# Altium schematic sheet InfraredEmitter.SchDoc
size A4; SheetNumber: 1; SheetTotal: 1
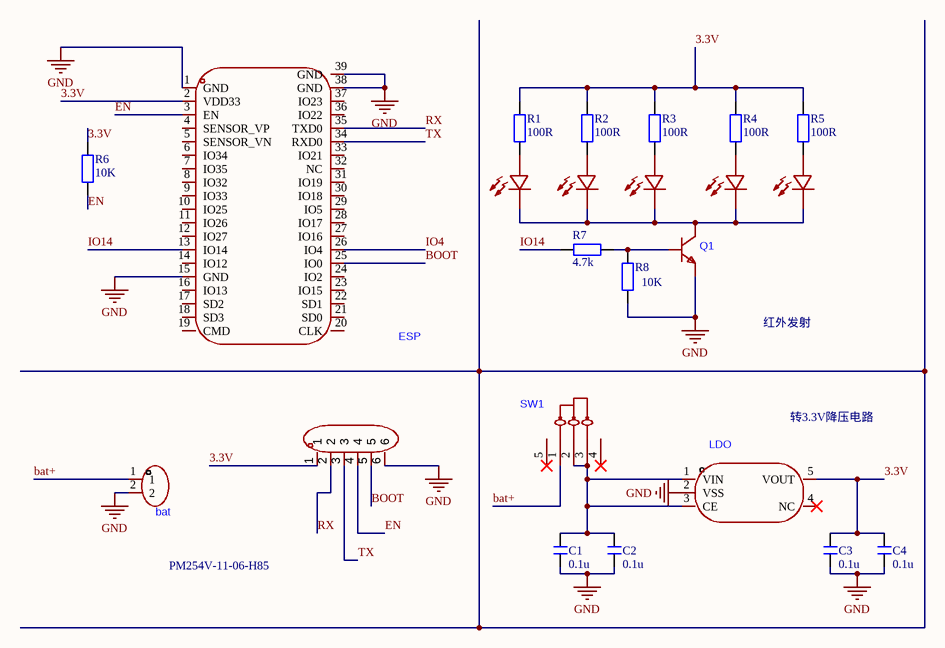
[diagram p0: InfraredEmitter.SchDoc]

## Parts
bat  HX-XH2.54-2PZZ  [CONN-TH_2P-P2.50_HX-2.54MM-2P-ZZ-MS]  (value not drawn)
C1  0.1u  [C 0805_L]
C2  0.1u  [C 0805_L]
C3  0.1u  [C 0805_L]
C4  0.1u  [C 0805_L]
ESP  ESP32-WROOM-32D-N4  [WIFIM-SMD_39P-L25.5-W18.0-P1.27-BL]  (value not drawn)
H??  PM254V-11-06-H85
LDO  ME6211C33M5G-N  [SOT-23-5_L3.0-W1.7-P0.95-LS2.8-BL]  (value not drawn)
Q1  S8050  [SOT-23-3_L2.9-W1.3-P1.90-LS2.4-BR]  (value not drawn)
R1  100R  [R 0805_L]
R2  100R  [R 0805_L]
R3  100R  [R 0805_L]
R4  100R  [R 0805_L]
R5  100R  [R 0805_L]
R6  10K  [R 0805_L]
R7  4.7k  [R 0805_L]
R8  10K  [R 0805_L]
Red1  XYC-IRP0603AC-A2  [LED0603-RD]  (value not drawn)
Red2  XYC-IRP0603AC-A2  [LED0603-RD]  (value not drawn)
Red3  XYC-IRP0603AC-A2  [LED0603-RD]  (value not drawn)
Red4  XYC-IRP0603AC-A2  [LED0603-RD]  (value not drawn)
Red5  XYC-IRP0603AC-A2  [LED0603-RD]  (value not drawn)
SW1  SK12D07VG3  [SW-TH_SK12D07VG3]  (value not drawn)

## Nets
GND: bat.2 C1.1 C2.1 C3.1 C4.1 ESP.1(GND) ESP.15(GND) ESP.38(GND) ESP.39(GND) H??.6 LDO.2(VSS) Q1.2(E) R8.1
3.3V: C3.2 C4.2 ESP.2(VDD33) H??.1 LDO.5(VOUT) R1.2 R2.2 R3.2 R4.2 R5.2 R6.2
bat+: bat.1 SW1.1
BOOT: ESP.25(IO0) H??.5
EN: ESP.3(EN) H??.4 R6.1
IO4: ESP.26(IO4)
IO14: ESP.13(IO14) R7.1
RX: ESP.35(TXD0) H??.2
TX: ESP.34(RXD0) H??.3
NetC1_2: C1.2 C2.2 LDO.1(VIN) LDO.3(CE) SW1.2 SW1.3
NetQ1_1: Q1.1(B) R7.2 R8.2
NetQ1_3: Q1.3(C) Red1.1(C) Red2.1(C) Red3.1(C) Red4.1(C) Red5.1(C)
NetR1_1: R1.1 Red1.2(A)
NetR2_1: R2.1 Red2.2(A)
NetR3_1: R3.1 Red3.2(A)
NetR4_1: R4.1 Red4.2(A)
NetR5_1: R5.1 Red5.2(A)

Not connected (* = marked no-connect by the designer): ESP 4(SENSOR_VP) 5(SENSOR_VN) 6(IO34) 7(IO35) 8(IO32) 9(IO33) 10(IO25) 11(IO26) 12(IO27) 14(IO12) 16(IO13) 17(SD2) 18(SD3) 19(CMD) 20(CLK) 21(SD0) 22(SD1) 23(IO15) 24(IO2) 27(IO16) 28(IO17) 29(IO5) 30(IO18) 31(IO19) 32(NC) 33(IO21) 36(IO22) 37(IO23); LDO 4(NC)*; SW1 4* 5*

## Notes on the sheet
- 红外发射
- 转3.3V降压电路

## Library data of the parts
bat = HX-XH2.54-2PZZ: Manufacturer: hanxia(韩下); Add into BOM: yes; Pins Structure: 1x2P; Pitch: 2.54mm; Reference Series: XH; Number of PINs Per Row: 2; Current Rating: 3A; Voltage Rating: 250V; Plastic Material: PA66; Flame Retardant Rating: UL94V-0; Symbol: HX-XH2.54-2PZZ; Device: HX-XH2.54-2PZZ; LCSC Part Name: 1x2P 间距:2.5mm 直插 系列:XH; Supplier Part: C42391660; Manufacturer Part: HX-XH2.54-2PZZ; Supplier Footprint: 插件,P=2.5mm; JLCPCB Part Class: Extended Part; Datasheet: https://item.szlcsc.com/datasheet/HX-XH2.54-2PZZ/44326932.html; Supplier: LCSC; Convert to PCB: yes; Mounting Type: 直插; Number of Pins: 2P; Number of Rows: 1; Row Spacing: -; Contact Material: 黄铜; Contact Plating: 锡; Operating Temperature: -25℃~+85℃; Color: 白色
C1-C4 = C: 贴片电容; BOM名称: 无极性贴片电容; 淘宝ID: 封装库来自淘宝 ID：黄晶宝石; 联系售后，技术支持: https://shop463601444.taobao.com; 唯一出售店铺网址: https://shop463601444.taobao.com
ESP = ESP32-WROOM-32D-N4: Manufacturer: ESPRESSIF(乐鑫); Add into BOM: yes; Symbol: ESP32-WROOM-32D; Device: ESP32-WROOM-32D-N4; LCSC Part Name: 通用型Wi-Fi+BT+BLE MCU模组; Supplier Part: C473012; Manufacturer Part: ESP32-WROOM-32D-N4; Supplier Footprint: SMD,18x25.5mm; JLCPCB Part Class: Extended Part; Datasheet: https://atta.szlcsc.com/upload/public/pdf/source/20191225/C473012_1E74417EE995DBCF17C94BD318A37DAB.pdf; Supplier: LCSC; Convert to PCB: yes
LDO = ME6211C33M5G-N: Manufacturer: MICRONE(南京微盟); Add into BOM: yes; Output Type: 固定; Voltage - Supply: 6V; Output Voltage: 3.3V; Output Current: 500mA; Power Supply Rejection Ratio (PSRR): 70dB@(1kHz); Voltage Dropout: 120mV@(100mA); standby current: 60uA; Noise: 50uVrms; Output Configuration: 正极; Number of Outputs: 1; Symbol: ME6211C33M5G-N; Device: ME6211C33M5G-N; LCSC Part Name: 输入6V 输出3.3V 500mA; Supplier Part: C82942; Manufacturer Part: ME6211C33M5G-N; Supplier Footprint: SOT-23-5; JLCPCB Part Class: Extended Part; Datasheet: https://atta.szlcsc.com/upload/public/pdf/source/20170918/C82942_1505727073070976520.pdf; Supplier: LCSC; Convert to PCB: yes; Features: 过流保护；带使能；短路保护; Operating Temperature: -40℃~+150℃
Q1 = S8050_C908252: Manufacturer: FUXINSEMI(富芯森美); Add into BOM: yes; type: NPN; Current - Collector(Ic): 500mA; Collector - Emitter Voltage VCEO: 25V; Pd - Power Dissipation: 300mW; Transition frequency(fT): 150MHz; Current - Collector Cutoff: 100nA; Vce Saturation(VCE(sat)): 600mV; Symbol: S8050_C908252; Device: S8050_C908252; LCSC Part Name: NPN 电流:500mA 电压:25V; Supplier Part: C908252; Manufacturer Part: S8050; Supplier Footprint: SOT-23; JLCPCB Part Class: Extended Part; Datasheet: https://item.szlcsc.com/datasheet/S8050/974494.html; Supplier: LCSC; Convert to PCB: yes; Operating Temperature: -
R1-R8 = R: 贴片电阻; 版权归属: 来自淘宝 ID：黄晶宝石; 封装库来自淘宝卖家 ID：黄晶宝石: 其他店铺购入均为盗版，不享受售后技术支持服务，请立即申请退款; BOM名称: 贴片电阻; 联系售后: https://shop463601444.taobao.com
Red1-Red5 = XYC-IRP0603AC-A2: Manufacturer: NEWOPTO(鑫永诚光电); Add into BOM: yes; Voltage - Forward(Vf): 1.3V~1.6V; Pd - Power Dissipation: 80mW; Wavelength: 850nm; Radiant Intensity: 2.25mW/sr; Current - DC Forward(If): 50mA; Voltage - DC Reverse(Vr): 5V; Viewing Angle: 140°; Symbol: XYC-IRP0603AC-A2; Device: XYC-IRP0603AC-A2; LCSC Part Name: 0603贴片850nm红外发射管; Supplier Part: C6081304; Manufacturer Part: XYC-IRP0603AC-A2; Supplier Footprint: 0603; JLCPCB Part Class: Extended Part; Datasheet: https://item.szlcsc.com/datasheet/XYC-IRP0603AC-A2/7022073.html; Supplier: LCSC; Convert to PCB: yes; Operating Temperature: -30℃~+85℃
SW1 = SK12D07VG3_1: Manufacturer: SHOU HAN(首韩); Symbol: SK12D07VG3_C431547; Add into BOM: yes; Circuit: 单刀双掷; Switch Height: 4.7mm; Current Rating: 500mA; Voltage Rating: 50V; Life: 5千次; Device: SK12D07VG3; LCSC Part Name: 两档位卧式拨动开关,柄长3MM; Supplier Part: C431547; Manufacturer Part: SK12D07VG3; Supplier Footprint: 插件,8.7x4.4mm; JLCPCB Part Class: Extended Part; Datasheet: https://item.szlcsc.com/datasheet/SK12D07VG3/427904.html; Supplier: LCSC; Convert to PCB: yes; Actuator Style: -; Termination Style: PC引脚; Length: 8.7mm; Width: 4.4mm; Mounting Type: -; Actuator Color: -; Operating Temperature: -10℃~+50℃
H?? = PM254V-11-06-H85: Symbol: PM254V-11-06-H85